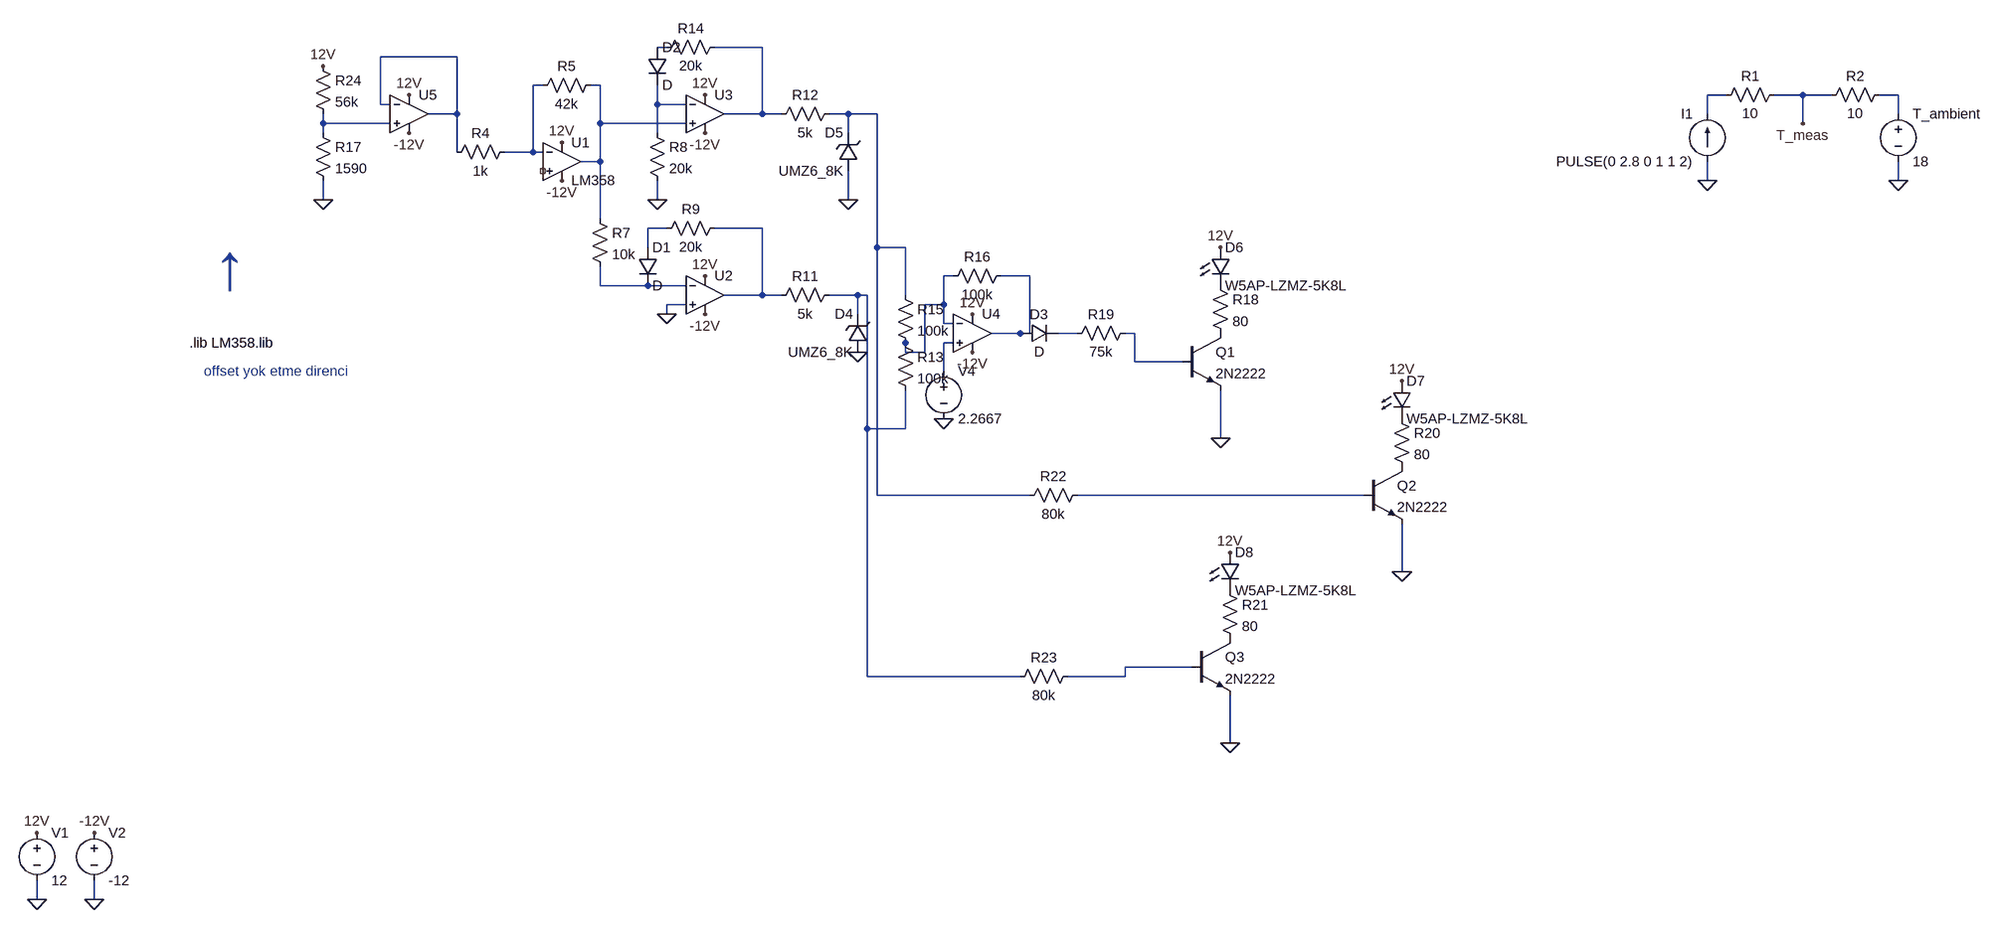
[diagram p0: schematic Display-Unit.asc]
Display-Unit.asc, the LTspice schematic file:
Version 4
SHEET 1 2712 1124
WIRE 496 -1824 480 -1824
WIRE 656 -1824 576 -1824
WIRE 144 -1808 16 -1808
WIRE 288 -1760 272 -1760
WIRE 384 -1760 368 -1760
WIRE 2272 -1744 2240 -1744
WIRE 2400 -1744 2352 -1744
WIRE 2448 -1744 2400 -1744
WIRE 2560 -1744 2528 -1744
WIRE 16 -1728 16 -1808
WIRE 32 -1728 16 -1728
WIRE 480 -1728 480 -1760
WIRE 528 -1728 480 -1728
WIRE 144 -1712 144 -1808
WIRE 144 -1712 96 -1712
WIRE 656 -1712 656 -1824
WIRE 656 -1712 592 -1712
WIRE 688 -1712 656 -1712
WIRE 800 -1712 768 -1712
WIRE 848 -1712 800 -1712
WIRE 2240 -1712 2240 -1744
WIRE 2560 -1712 2560 -1744
WIRE -80 -1696 -80 -1712
WIRE 32 -1696 -80 -1696
WIRE 384 -1696 384 -1760
WIRE 528 -1696 384 -1696
WIRE 2400 -1696 2400 -1744
WIRE -80 -1680 -80 -1696
WIRE 480 -1680 480 -1728
WIRE 800 -1680 800 -1712
WIRE 144 -1648 144 -1712
WIRE 272 -1648 272 -1760
WIRE 272 -1648 224 -1648
WIRE 288 -1648 272 -1648
WIRE 384 -1632 384 -1696
WIRE 384 -1632 352 -1632
WIRE 2240 -1600 2240 -1632
WIRE 2560 -1600 2560 -1632
WIRE -80 -1568 -80 -1600
WIRE 480 -1568 480 -1600
WIRE 800 -1568 800 -1616
WIRE 384 -1536 384 -1632
WIRE 496 -1520 464 -1520
WIRE 656 -1520 576 -1520
WIRE 464 -1488 464 -1520
WIRE 848 -1488 848 -1712
WIRE 896 -1488 848 -1488
WIRE 976 -1440 960 -1440
WIRE 1104 -1440 1056 -1440
WIRE 384 -1424 384 -1456
WIRE 464 -1424 384 -1424
WIRE 528 -1424 464 -1424
WIRE 656 -1408 656 -1520
WIRE 656 -1408 592 -1408
WIRE 688 -1408 656 -1408
WIRE 816 -1408 768 -1408
WIRE 832 -1408 816 -1408
WIRE 896 -1408 896 -1488
WIRE 528 -1392 496 -1392
WIRE 960 -1392 960 -1440
WIRE 960 -1392 928 -1392
WIRE 496 -1376 496 -1392
WIRE 816 -1376 816 -1408
WIRE 960 -1360 960 -1392
WIRE 976 -1360 960 -1360
WIRE 1088 -1344 1040 -1344
WIRE 1104 -1344 1104 -1440
WIRE 1104 -1344 1088 -1344
WIRE 1184 -1344 1152 -1344
WIRE 1280 -1344 1264 -1344
WIRE 976 -1328 960 -1328
WIRE 896 -1312 896 -1328
WIRE 928 -1312 928 -1392
WIRE 928 -1312 896 -1312
WIRE 1280 -1296 1280 -1344
WIRE 1360 -1296 1280 -1296
WIRE 960 -1280 960 -1328
WIRE 832 -1184 832 -1408
WIRE 896 -1184 896 -1248
WIRE 896 -1184 832 -1184
WIRE 1424 -1168 1424 -1248
WIRE 848 -1072 848 -1488
WIRE 1104 -1072 848 -1072
WIRE 1664 -1072 1184 -1072
WIRE 1728 -944 1728 -1024
WIRE 1376 -784 1264 -784
WIRE 832 -768 832 -1184
WIRE 1088 -768 832 -768
WIRE 1264 -768 1264 -784
WIRE 1264 -768 1168 -768
WIRE 1440 -656 1440 -736
WIRE -1440 -320 -1440 -352
WIRE -1344 -320 -1344 -352
FLAG 2560 -1600 0
FLAG 2240 -1600 0
FLAG 2400 -1696 T_meas
FLAG -1440 -320 0
FLAG -1440 -432 12V
FLAG -1344 -320 0
FLAG -1344 -432 -12V
FLAG 320 -1600 -12V
FLAG 320 -1664 12V
FLAG -80 -1568 0
FLAG -80 -1792 12V
FLAG 496 -1376 0
FLAG 560 -1376 -12V
FLAG 560 -1440 12V
FLAG 816 -1312 0
FLAG 800 -1568 0
FLAG 560 -1680 -12V
FLAG 560 -1744 12V
FLAG 480 -1568 0
FLAG 1008 -1312 -12V
FLAG 1008 -1376 12V
FLAG 960 -1200 0
FLAG 1424 -1168 0
FLAG 1424 -1488 12V
FLAG 1728 -944 0
FLAG 1728 -1264 12V
FLAG 1440 -656 0
FLAG 1440 -976 12V
FLAG 64 -1680 -12V
FLAG 64 -1744 12V
SYMBOL voltage 2560 -1728 R0
WINDOW 123 0 0 Left 0
WINDOW 39 0 0 Left 0
SYMATTR InstName T_ambient
SYMATTR Value 18
SYMBOL res 2368 -1760 R90
WINDOW 0 0 56 VBottom 2
WINDOW 3 32 56 VTop 2
SYMATTR InstName R1
SYMATTR Value 10
SYMBOL res 2544 -1760 R90
WINDOW 0 0 56 VBottom 2
WINDOW 3 32 56 VTop 2
SYMATTR InstName R2
SYMATTR Value 10
SYMBOL current 2240 -1632 R180
WINDOW 0 24 80 Left 2
WINDOW 3 24 0 Left 2
WINDOW 123 0 0 Left 0
WINDOW 39 0 0 Left 0
SYMATTR InstName I1
SYMATTR Value PULSE(0 2.8 0 1 1 2)
SYMBOL voltage -1440 -448 R0
SYMATTR InstName V1
SYMATTR Value 12
SYMBOL voltage -1344 -448 R0
WINDOW 123 0 0 Left 0
WINDOW 39 0 0 Left 0
SYMATTR InstName V2
SYMATTR Value -12
SYMBOL res 384 -1776 R90
WINDOW 0 0 56 VBottom 2
WINDOW 3 32 56 VTop 2
SYMATTR InstName R5
SYMATTR Value 42k
SYMBOL res 240 -1664 R90
WINDOW 0 0 56 VBottom 2
WINDOW 3 32 56 VTop 2
SYMATTR InstName R4
SYMATTR Value 1k
SYMBOL Opamps\\opamp2 320 -1696 R0
SYMATTR InstName U1
SYMATTR Value LM358
SYMBOL res 368 -1552 R0
SYMATTR InstName R7
SYMATTR Value 10k
SYMBOL res 592 -1536 R90
WINDOW 0 0 56 VBottom 2
WINDOW 3 32 56 VTop 2
SYMATTR InstName R9
SYMATTR Value 20k
SYMBOL zener 832 -1312 R180
WINDOW 0 24 64 Left 2
WINDOW 3 24 0 Left 2
SYMATTR InstName D4
SYMATTR Value UMZ6_8K
SYMBOL res 784 -1424 R90
WINDOW 0 0 56 VBottom 2
WINDOW 3 32 56 VTop 2
SYMATTR InstName R11
SYMATTR Value 5k
SYMBOL Opamps\\UniversalOpamp2 560 -1408 R0
SYMATTR InstName U2
SYMBOL zener 816 -1616 R180
WINDOW 0 24 64 Left 2
WINDOW 3 24 0 Left 2
SYMATTR InstName D5
SYMATTR Value UMZ6_8K
SYMBOL res 784 -1728 R90
WINDOW 0 0 56 VBottom 2
WINDOW 3 32 56 VTop 2
SYMATTR InstName R12
SYMATTR Value 5k
SYMBOL res 592 -1840 R90
WINDOW 0 0 56 VBottom 2
WINDOW 3 32 56 VTop 2
SYMATTR InstName R14
SYMATTR Value 20k
SYMBOL Opamps\\UniversalOpamp2 560 -1712 R0
SYMATTR InstName U3
SYMBOL res 464 -1696 R0
SYMATTR InstName R8
SYMATTR Value 20k
SYMBOL diode 448 -1488 R0
SYMATTR InstName D1
SYMBOL diode 464 -1824 R0
SYMATTR InstName D2
SYMBOL Opamps\\UniversalOpamp2 1008 -1344 R0
SYMATTR InstName U4
SYMBOL res 880 -1344 R0
SYMATTR InstName R13
SYMATTR Value 100k
SYMBOL res 880 -1424 R0
SYMATTR InstName R15
SYMATTR Value 100k
SYMBOL res 1072 -1456 R90
WINDOW 0 0 56 VBottom 2
WINDOW 3 32 56 VTop 2
SYMATTR InstName R16
SYMATTR Value 100k
SYMBOL voltage 960 -1296 R0
WINDOW 123 0 0 Left 0
WINDOW 39 0 0 Left 0
SYMATTR InstName V4
SYMATTR Value 2.2667
SYMBOL diode 1088 -1328 R270
WINDOW 0 32 32 VTop 2
WINDOW 3 0 32 VBottom 2
SYMATTR InstName D3
SYMBOL npn 1360 -1344 R0
SYMATTR InstName Q1
SYMATTR Value 2N2222
SYMBOL res 1280 -1360 R90
WINDOW 0 0 56 VBottom 2
WINDOW 3 32 56 VTop 2
SYMATTR InstName R19
SYMATTR Value 75k
SYMBOL LED 1408 -1488 R0
SYMATTR InstName D6
SYMATTR Value W5AP-LZMZ-5K8L
SYMATTR Description Diode
SYMATTR Type diode
SYMBOL res 1408 -1440 R0
SYMATTR InstName R18
SYMATTR Value 80
SYMBOL npn 1664 -1120 R0
SYMATTR InstName Q2
SYMATTR Value 2N2222
SYMBOL LED 1712 -1264 R0
SYMATTR InstName D7
SYMATTR Value W5AP-LZMZ-5K8L
SYMATTR Description Diode
SYMATTR Type diode
SYMBOL res 1712 -1216 R0
SYMATTR InstName R20
SYMATTR Value 80
SYMBOL npn 1376 -832 R0
SYMATTR InstName Q3
SYMATTR Value 2N2222
SYMBOL LED 1424 -976 R0
SYMATTR InstName D8
SYMATTR Value W5AP-LZMZ-5K8L
SYMATTR Description Diode
SYMATTR Type diode
SYMBOL res 1424 -928 R0
SYMATTR InstName R21
SYMATTR Value 80
SYMBOL res 1200 -1088 R90
WINDOW 0 0 56 VBottom 2
WINDOW 3 32 56 VTop 2
SYMATTR InstName R22
SYMATTR Value 80k
SYMBOL res 1184 -784 R90
WINDOW 0 0 56 VBottom 2
WINDOW 3 32 56 VTop 2
SYMATTR InstName R23
SYMATTR Value 80k
SYMBOL res -96 -1696 R0
SYMATTR InstName R17
SYMATTR Value 1590
SYMBOL res -96 -1808 R0
SYMATTR InstName R24
SYMATTR Value 56k
SYMBOL Opamps\\UniversalOpamp2 64 -1712 R0
SYMATTR InstName U5
TEXT -304 -1328 Left 2 !.lib LM358.lib
TEXT -280 -1280 Left 2 ;offset yok etme direnci
TEXT -264 -1456 Left 7 ;↑

The netlist it stands for:
* Display-Unit.asc
V§T_ambient N007 0 18
R1 T_meas N006 10
R2 N007 T_meas 10
I1 0 N006 PULSE(0 2.8 0 1 1 2)
V1 12V 0 12
V2 -12V 0 -12
R5 N005 N004 42k
R4 N004 N003 1k
XU1 NC_01 N004 12V -12V N005 LM358  ; pins In+ In- V+ V- OUT
R7 N005 N015 10k
R9 N012 N011 20k
D4 0 N016 UMZ6_8K
R11 N016 N012 5k
XU2 0 N015 12V -12V N012 level.2 Avol=1Meg GBW=10Meg Slew=10Meg ilimit=25m rail=0 Vos=0 phimargin=45 en=0 enk=0 in=0 ink=0 Rin=500Meg  ; pins IN+ IN- V+ V- OUT
D5 0 N009 UMZ6_8K
R12 N009 N002 5k
R14 N002 N001 20k
XU3 N005 N008 12V -12V N002 level.2 Avol=1Meg GBW=10Meg Slew=10Meg ilimit=25m rail=0 Vos=0 phimargin=45 en=0 enk=0 in=0 ink=0 Rin=500Meg  ; pins IN+ IN- V+ V- OUT
R8 N008 0 20k
D1 N011 N015 D
D2 N001 N008 D
XU4 N019 N013 12V -12V N014 level.2 Avol=1Meg GBW=10Meg Slew=10Meg ilimit=25m rail=0 Vos=0 phimargin=45 en=0 enk=0 in=0 ink=0 Rin=500Meg  ; pins IN+ IN- V+ V- OUT
R13 N013 N016 100k
R15 N009 N013 100k
R16 N014 N013 100k
V4 N019 0 2.2667
D3 N014 N017 D
Q1 P001 N018 0 0 2N2222
R19 N018 N017 75k
D6 12V P002 W5AP-LZMZ-5K8L
R18 P002 P001 80
Q2 P003 N020 0 0 2N2222
D7 12V P004 W5AP-LZMZ-5K8L
R20 P004 P003 80
Q3 P005 N021 0 0 2N2222
D8 12V P006 W5AP-LZMZ-5K8L
R21 P006 P005 80
R22 N020 N009 80k
R23 N021 N016 80k
R17 N010 0 1590
R24 12V N010 56k
XU5 N010 N003 12V -12V N003 level.2 Avol=1Meg GBW=10Meg Slew=10Meg ilimit=25m rail=0 Vos=0 phimargin=45 en=0 enk=0 in=0 ink=0 Rin=500Meg  ; pins IN+ IN- V+ V- OUT
.model D D
.lib standard.dio
.model NPN NPN
.model PNP PNP
.lib standard.bjt
.lib LM358.lib
* offset yok etme direnci
* ↑
.lib UniversalOpamps2.sub
.backanno
.end